# EAGLE design avr_plc (EAGLE 9.6.0)
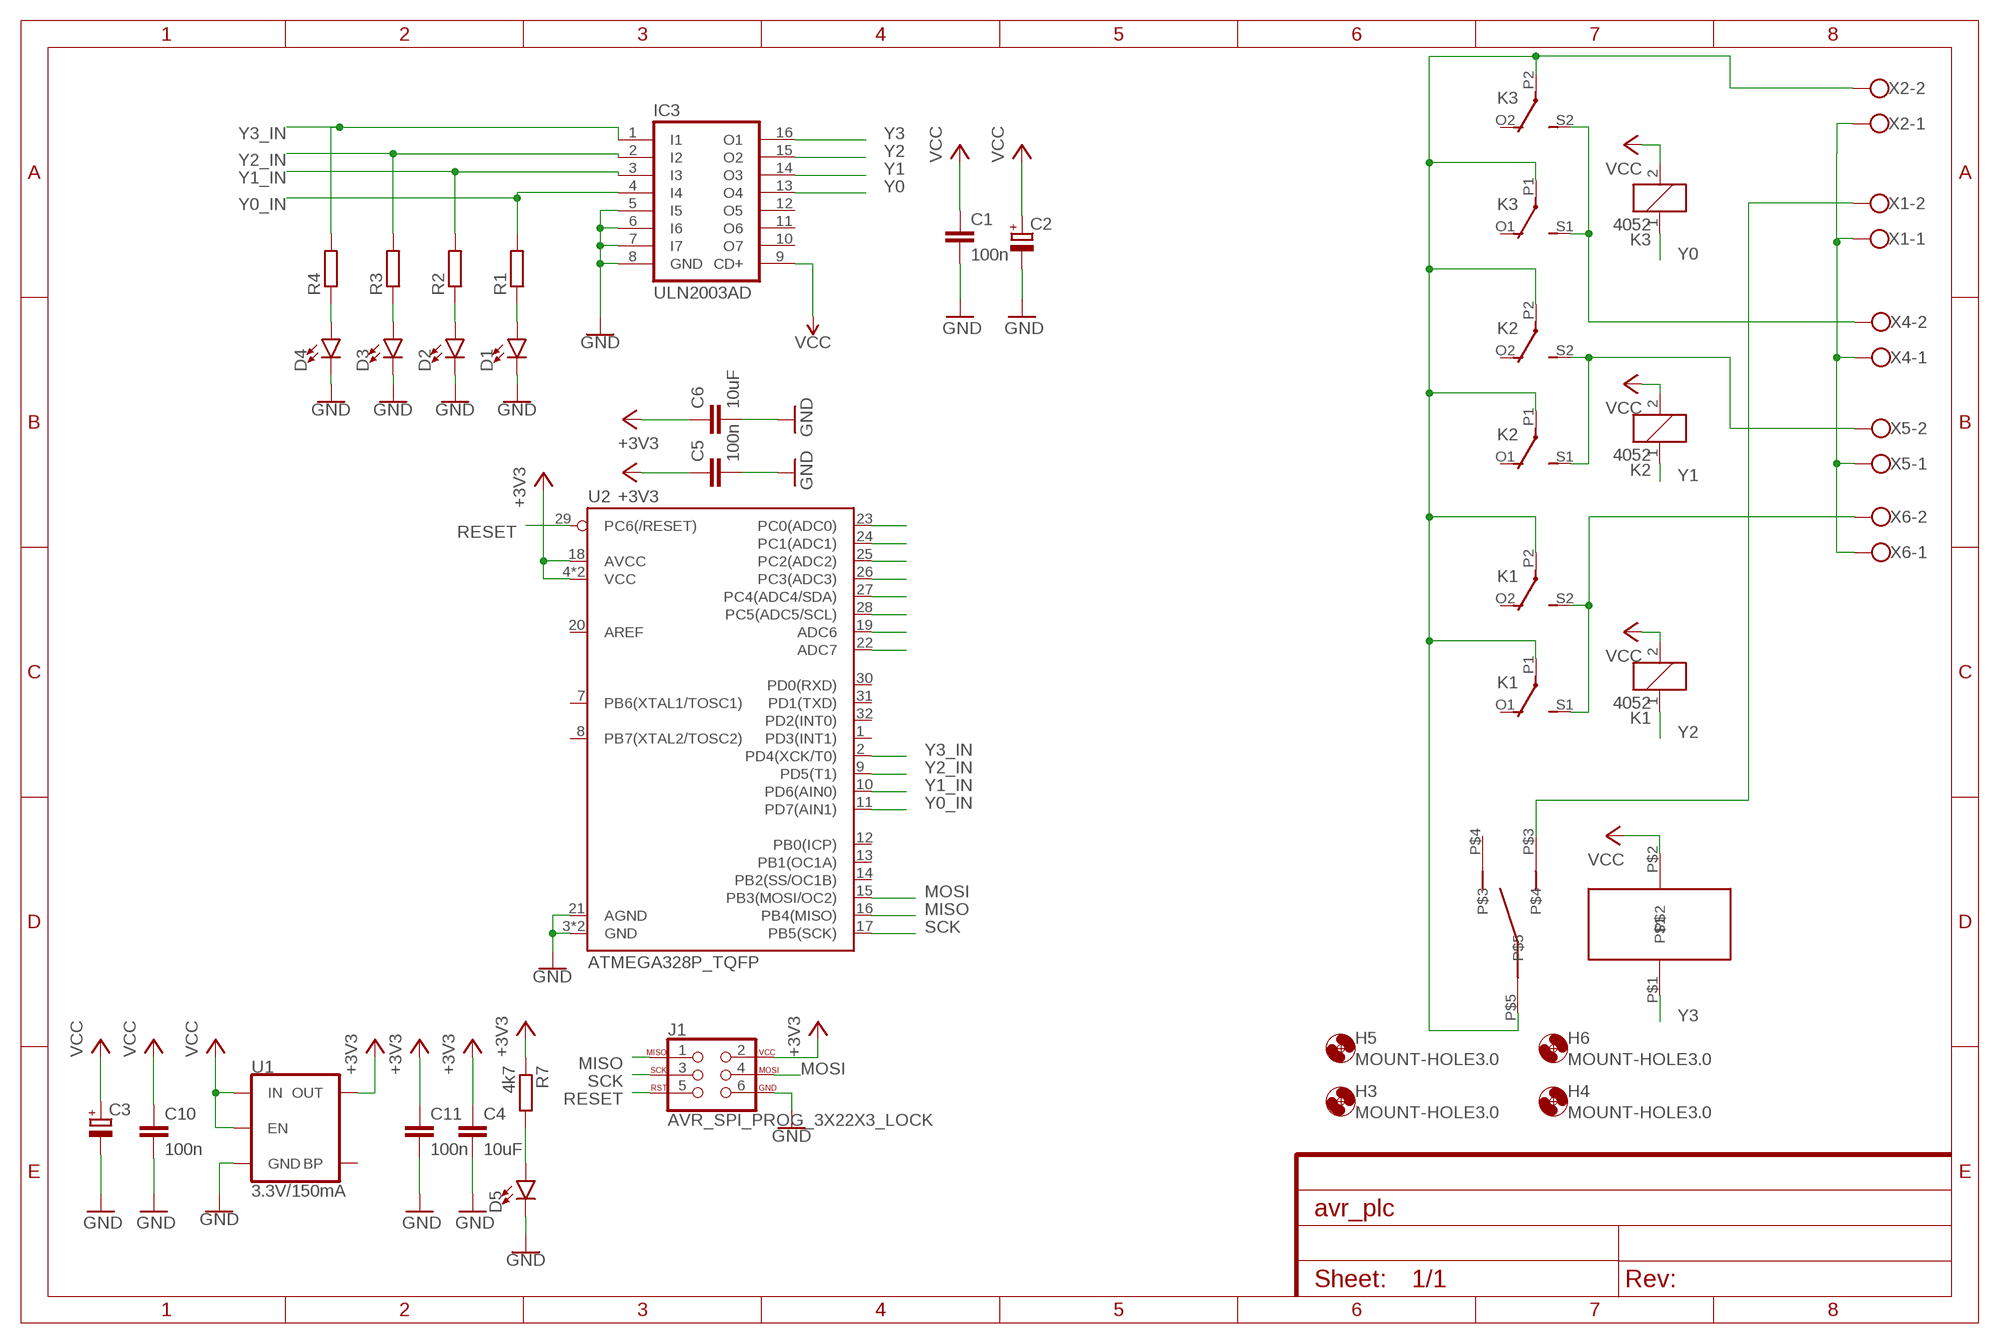
[diagram p0: schematic, sheet 1]

## Parts
C1  100n  C-EUC0805  [C0805]
C2  CPOL-EU153CLV-0810  [153CLV-0810]
C3  CPOL-EU153CLV-0810  [153CLV-0810]
C4  10uF  C-EUC0805  [C0805]
C5  100n  C-EUC0805  [C0805]
C6  10uF  C-EUC0805  [C0805]
C10  100n  C-EUC0805  [C0805]
C11  100n  C-EUC0805  [C0805]
D1  LED1206  [LED-1206]
D2  LED1206  [LED-1206]
D3  LED1206  [LED-1206]
D4  LED1206  [LED-1206]
D5  LED1206  [LED-1206]
H3  MOUNT-HOLE3.0  [3,0]
H4  MOUNT-HOLE3.0  [3,0]
H5  MOUNT-HOLE3.0  [3,0]
H6  MOUNT-HOLE3.0  [3,0]
IC3  ULN2003AD  [SO16]
J1  AVR_SPI_PROG_3X22X3_LOCK  [2X3_LOCK]
K1  4052  [F4052]
K2  4052  [F4052]
K3  4052  [F4052]
R1  R-EU_R0805  [R0805]
R2  R-EU_R0805  [R0805]
R3  R-EU_R0805  [R0805]
R4  R-EU_R0805  [R0805]
R7  4k7  R-EU_M0805  [M0805]
U1  3.3V/150mA  V_REG_MIC52053.3V  [SOT23-5]
U2  ATMEGA328P_TQFP  [TQFP32-08]
U$1  T9G_RELAY  [T9G_RELAY]
X1  W239-302  [W239-302]
X2  W239-302  [W239-302]
X4  W237-102  [W237-102]
X5  W237-102  [W237-102]
X6  W237-102  [W237-102]

## Nets
+3V3: C4.1 C5.1 C6.1 C11.1 J1.2 R7.1 U1.5(OUT) U2.4(VCC) U2.6(VCC) U2.18(AVCC)
GND: C1.2 C2.- C3.- C4.2 C5.2 C6.2 C10.2 C11.2 D1.C D2.C D3.C D4.C D5.C IC3.5(I5) IC3.6(I6) IC3.7(I7) IC3.8(GND) J1.6 U1.2(GND) U2.3(GND) U2.5(GND) U2.21(AGND)
MISO: J1.1 U2.16(PB4(MISO))
MOSI: J1.4 U2.15(PB3(MOSI/OC2))
N$2: D1.A R1.1
N$4: D2.A R2.1
N$6: D3.A R3.1
N$8: D4.A R4.1
N$9: D5.A R7.2
N$10: K1.P1(2:P) K1.P2(3:P) K2.P1(2:P) K2.P2(3:P) K3.P1(2:P) K3.P2(3:P) U$1.P$5 X2.2
N$11: U$1.P$3 X1.2
N$16: U2.23(PC0(ADC0))
N$17: X1.1 X2.1 X4.1 X5.1 X6.1
N$18: U2.24(PC1(ADC1))
N$19: U2.25(PC2(ADC2))
N$20: K1.S1(2:S) K1.S2(3:S) X6.2
N$21: K2.S1(2:S) K2.S2(3:S) X5.2
N$22: K3.S1(2:S) K3.S2(3:S) X4.2
N$23: U2.26(PC3(ADC3))
N$24: U2.27(PC4(ADC4/SDA))
N$25: U2.28(PC5(ADC5/SCL))
N$26: U2.19(ADC6)
N$27: U2.22(ADC7)
RESET: J1.5 U2.29(PC6(/RESET))
SCK: J1.3 U2.17(PB5(SCK))
VCC: C1.1 C2.+ C3.+ C10.1 IC3.9(CD+) K1.2 K2.2 K3.2 U1.1(IN) U1.3(EN) U$1.P$2
Y0: IC3.13(O4) K3.1
Y0_IN: IC3.4(I4) R1.2 U2.11(PD7(AIN1))
Y1: IC3.14(O3) K2.1
Y1_IN: IC3.3(I3) R2.2 U2.10(PD6(AIN0))
Y2: IC3.15(O2) K1.1
Y2_IN: IC3.2(I2) R3.2 U2.9(PD5(T1))
Y3: IC3.16(O1) U$1.P$1
Y3_IN: IC3.1(I1) R4.2 U2.2(PD4(XCK/T0))
Unconnected: IC3.10(O7) IC3.11(O6) IC3.12(O5) K1.O1(2:O) K1.O2(3:O) K2.O1(2:O) K2.O2(3:O) K3.O1(2:O) K3.O2(3:O) U1.4(BP) U2.1(PD3(INT1)) U2.7(PB6(XTAL1/TOSC1)) U2.8(PB7(XTAL2/TOSC2)) U2.12(PB0(ICP)) U2.13(PB1(OC1A)) U2.14(PB2(SS/OC1B)) U2.20(AREF) U2.30(PD0(RXD)) U2.31(PD1(TXD)) U2.32(PD2(INT0)) U$1.P$4

## Library data of the parts
C1 C4-C6 C10 C11 = rcl:C-EU: CAPACITOR, European symbol; SPICEPREFIX: C
C2 C3 = rcl:CPOL-EU: POLARIZED CAPACITOR, European symbol; SPICEPREFIX: C
D1-D5 = SparkFun-LED:LED: LED (Generic) Standard schematic elements and footprints for 5mm, 3mm, 1206, and 0603 sized LEDs. Generic LEDs with no color specified.
H3-H6 = holes:MOUNT-HOLE: MOUNTING HOLE with drill center marker
IC3 = uln-udn:ULN2003A: DRIVER ARRAY
J1 = SparkFun-Connectors:AVR_SPI_PROG_3X2: AVR ISP 6 Pin This is the reduced ISP connector for AVR programming. Common on Arduino. This footprint will take up less PCB space and can be used with a 10-pin to 6-pin adapter such as SKU: BOB-08508 **Special note about "TEST_POINT" package. The stop mask is on the top side, so if you want your programming test points to be on the bottom of your board, make sure to place this package on the bottom side of the board. This also ensure that the orientation to program from the bottom side will be correct. SparkFun Products: SparkFun ISP Pogo Adapter <https://www.sparkfun.com/products/11591> - NS Tiny AVR Programmer <https://www.sparkfun.com/products/11801> -PTH
K1-K3 = relay:4052: RELAY 2 x switch, Finder; OC_FARNELL: unknown; OC_NEWARK: unknown
R1-R4 R7 = rcl:R-EU_: RESISTOR, European symbol; SPICEPREFIX: R
U1 = SparkFun-IC-Power:V_REG_MIC5205: V_REG MIC5205 Standard 3.3V, 5V, and Adjustable 150mA LDO voltage regulator in SOT-23 layout. Micrel part MIC5205. BP (by-pass) pin is used to lower output noise with 470pF cap, may be left open. On the adjustable version BP is used to set output.; PROD_ID: VREG-00822
U2 = SparkFun-IC-Microcontroller:ATMEGA328P_TQFP: Popular 328P in QFP Storefront component: ATmega328 - TQFP <https://www.sparkfun.com/products/13448> (COM-13448) Datasheet <http://www.sparkfun.com/datasheets/Components/SMD/ATMega328.pdf> SparkFun Products SparkFun RedBoard - Programmed with Arduino <https://www.sparkfun.com/products/12757> (DEV-12757) Arduino Pro Mini 328 - 5V/16MHz <https://www.sparkfun.com/products/11113> (DEV-11113) Arduino Pro Mini 328 - 3.3V/8MHz <https://www.sparkfun.com/products/11114> (DEV-11114) SparkFun OpenLog <https://www.sparkfun.com/products/13712> (DEV-13712) SparkFun MicroView - OLED Arduino Module <https://www.sparkfun.com/products/12923> (DEV-12923) SparkFun Digital Sandbox <https://www.sparkfun.com/products/12651> (DEV-12651) SparkFun PicoBoard <https://www.sparkfun.com/products/11888> (WIG-11888) Arduino Fio <https://www.sparkfun.com/products/10116> (DEV-10116) LilyPad Arduino 328 Main Board <https://www.sparkfun.com/products/13342> (DEV-13342) SparkFun RedStick <https://www.sparkfun.com/products/13741> (DEV-13741) LilyPad MP3 <https://www.sparkfun.com/products/11013> (DEV-11013) LilyPad Arduino SimpleSnap <https://www.sparkfun.com/products/10941> (DEV-10941) SparkFun Stepoko <https://www.sparkfun.com/products/13899> (ROB-13899) SparkFun Geiger Counter <https://www.sparkfun.com/products/11345> (SEN-11345) SparkFun EL Sequencer <https://www.sparkfun.com/products/12781> (COM-12781) Arduino Pro 328 - 5V/16MHz <https://www.sparkfun.com/products/10915> (DEV-10915) CryptoCape <https://www.sparkfun.com/products/12773> (DEV-12773) SparkFun IR Thermometer Evaluation Board - MLX90614 <https://www.sparkfun.com/products/10740> (SEN-10740) SparkFun RedBot Mainboard <https://www.sparkfun.com/products/12097> (ROB-12097) Arduino Pro 328 - 3.3V/8MHz <https://www.sparkfun.com/products/10914> (DEV-10914) SparkFun Block for Intel® Edison - Arduino <https://www.sparkfun.com/products/13036> (DEV-13036) SparkFun Simon Says - Surface Mount Soldering Kit <https://www.sparkfun.com/products/10935> (KIT-10935) SparkFun 7-Segment Serial Display - Red <https://www.sparkfun.com/products/11441> (COM-11441) SparkFun 7-Segment Serial Display - White <https://www.sparkfun.com/products/11629> (COM-11629) SparkFun 7-Segment Serial Display - Yellow <https://www.sparkfun.com/products/11443> (COM-11443) SparkFun 7-Segment Serial Display - Kelly Green <https://www.sparkfun.com/products/11440> (COM-11440) SparkFun 7-Segment Serial Display - Blue <https://www.sparkfun.com/products/11442> (COM-11442) SparkFun OpenSegment Serial Display - 20mm (Blue) <https://www.sparkfun.com/products/11647> (COM-11647) SparkFun OpenSegment Serial Display - 20mm (Green) <https://www.sparkfun.com/products/11646> (COM-11646) SparkFun OpenSegment Serial Display - 20mm (White) <https://www.sparkfun.com/products/11648> (COM-11648) SparkFun OpenSegment Serial Display - 20mm (Red) <https://www.sparkfun.com/products/11644> (COM-11644) SparkFun OpenSegment Serial Display - 20mm (Yellow) <https://www.sparkfun.com/products/11645> (COM-11645) SparkFun OpenSegment Shield <https://www.sparkfun.com/products/13190> (DEV-13190); PROD_ID: IC-09069
U$1 = my_library:T9G_RELAY
X1 X2 = con-wago-500:W239-302: WAGO SCREW CLAMP; OC_FARNELL: unknown; OC_NEWARK: unknown
X4-X6 = con-wago-500:W237-102: WAGO SCREW CLAMP; MPN: 237-102; OC_FARNELL: unknown; OC_NEWARK: 70K9898

## Board
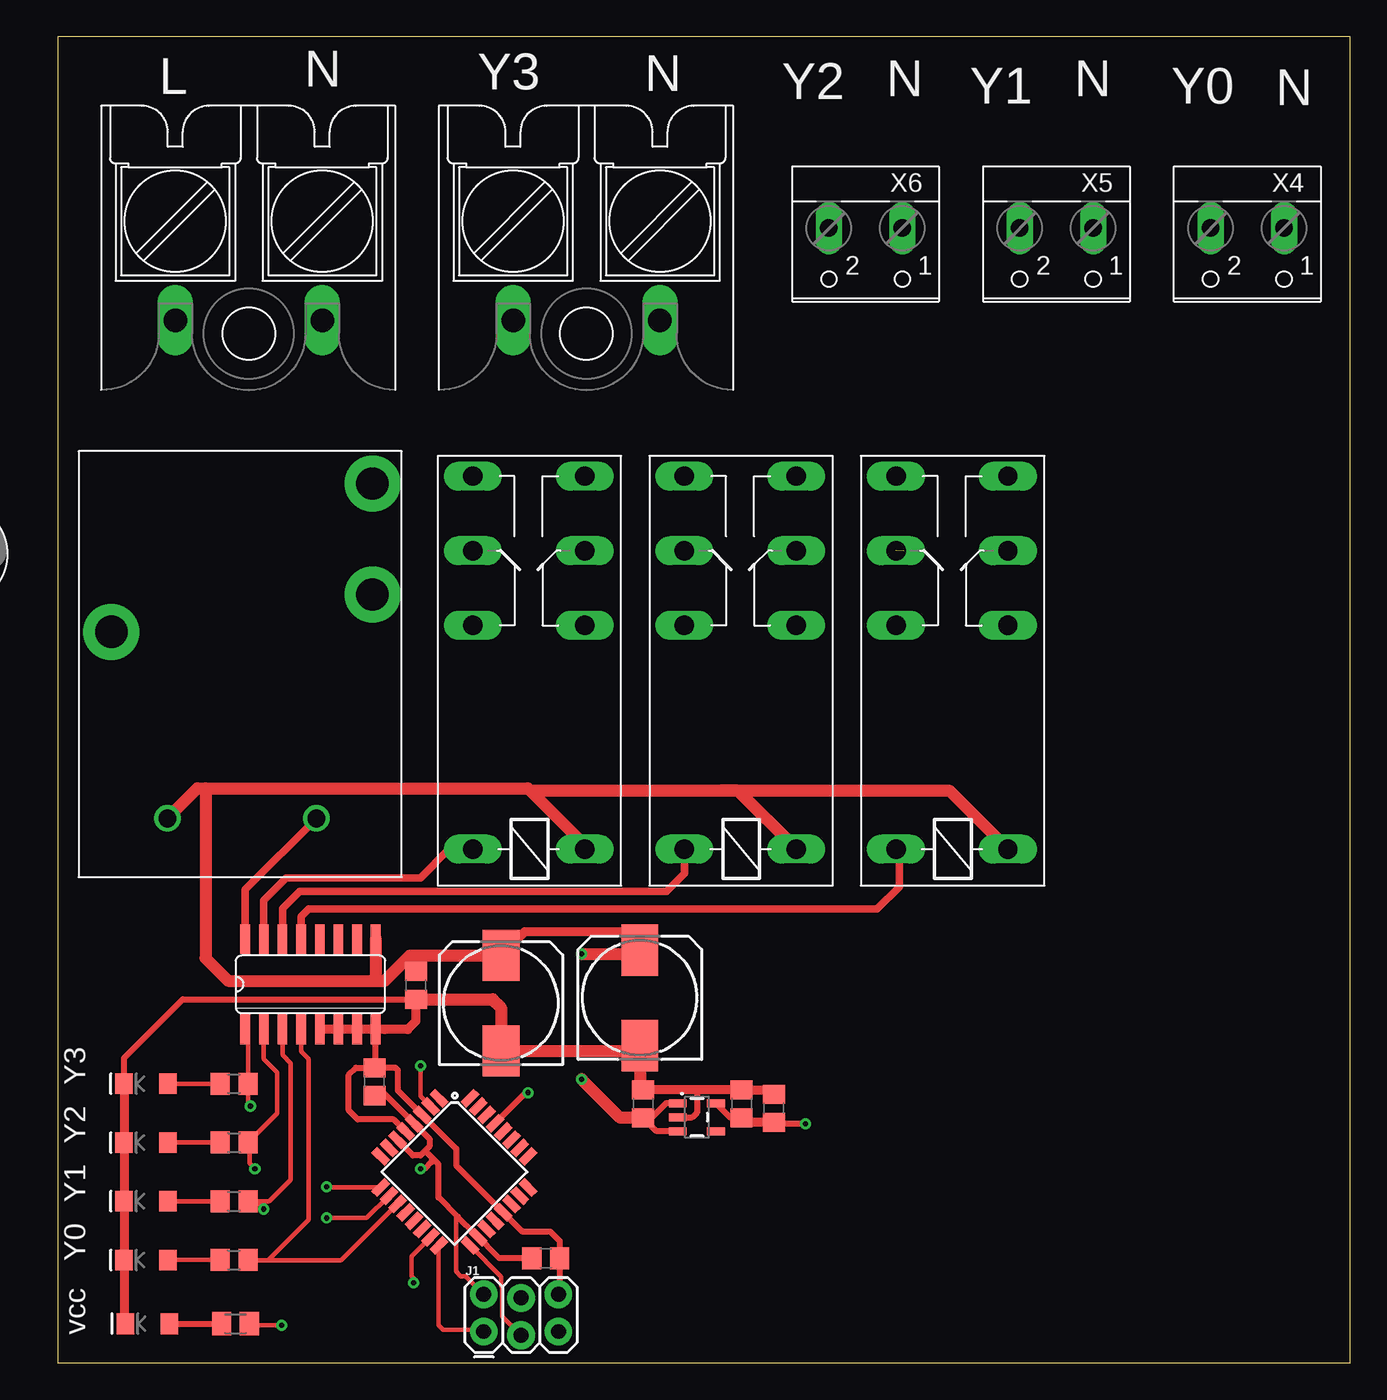
[diagram p1: board, top side]
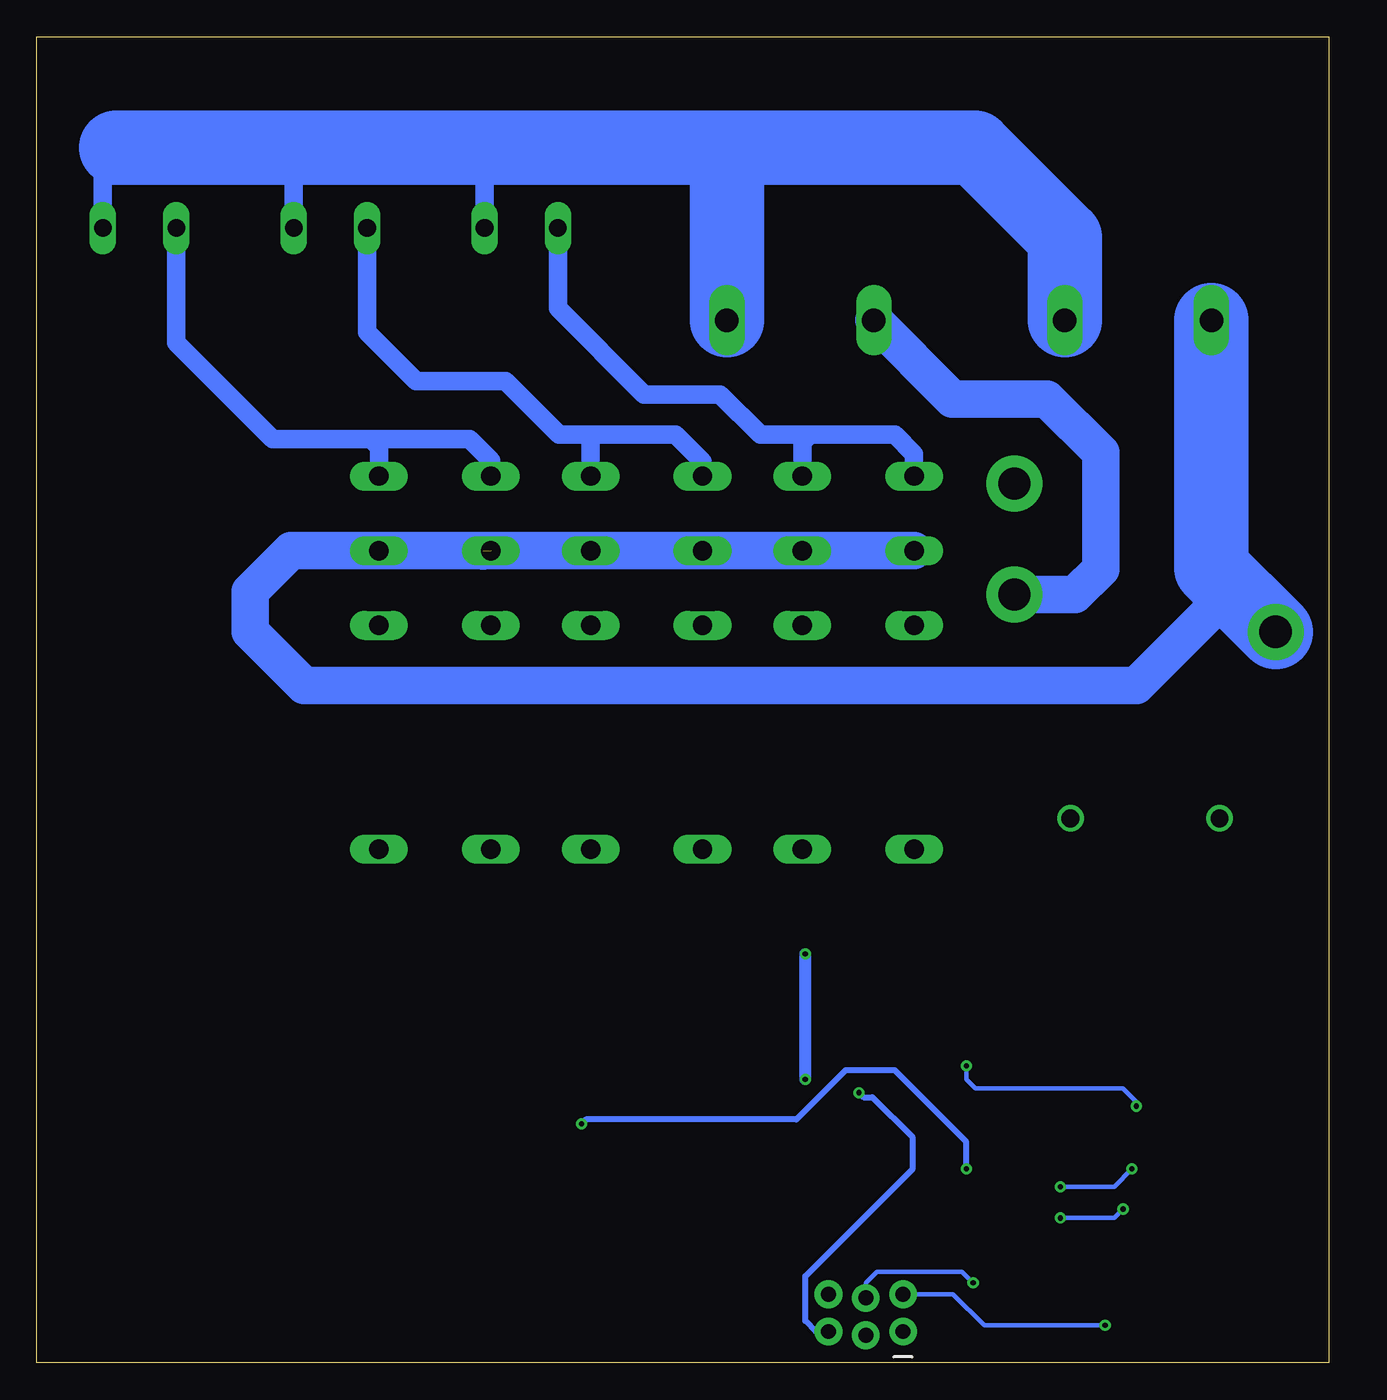
[diagram p2: board, bottom side, seen from below]

Size 88 x 90.3 mm. Coordinates in mm from the lower left corner, seen from the top.
Outline: 0,0 88,0 88,90.31 0,90.31 0,0
Copper layers (1*16): Top 0.035mm / dielectric 1.5mm / Bottom 0.035mm
Design rules "default": minimum track width 6mil, minimum drill 0.35mm, track to track 6mil, track to pad 6mil, pad to pad 6mil, via to via 6mil, smd to smd 6mil, copper to edge 40mil, drill to drill 6mil, minimum pad ring 10mil, minimum via ring 8mil, stop-mask expansion 4mil, vias tented up to drill 0mil, thermal gap 10mil

### Footprints (pad centres in the part's own frame; a part is rotated, then mirrored left to right if it is on the bottom)
C0805 = smd 1.3 x 1.5: 1 -0.95,0; 2 0.95,0
153CLV-0810 = smd 3.5 x 2.5: + 3.25,0; - -3.25,0
LED-1206 = smd 1.2 x 1.4: A -1.5,0; C 1.5,0
3,0 = hole 3: 0,0
SO16 = smd 0.66 x 2.032: 1 -4.445,-3.073; 2 -3.175,-3.073; 3 -1.905,-3.073; 4 -0.635,-3.073; 5 0.635,-3.073; 6 1.905,-3.073; 7 3.175,-3.073; 8 4.445,-3.073; 9 4.445,3.073; 10 3.175,3.073; 11 1.905,3.073; 12 0.635,3.073; 13 -0.635,3.073; 14 -1.905,3.073; 15 -3.175,3.073; 16 -4.445,3.073
2X3_LOCK = drill 1.016 pad 1.88: 1 0,0.127; 2 0,2.667; 3 2.54,-0.127; 4 2.54,2.413; 5 5.08,0.127; 6 5.08,2.667
F4052 = drill 1.321 long: 1 -3.81,3.81; 2 -3.81,-3.81; O1 11.43,-3.81; O2 11.43,3.81; P1 16.51,-3.81; P2 16.51,3.81; S1 21.59,-3.81; S2 21.59,3.81
R0805 = smd 1.3 x 1.5: 1 -0.95,0; 2 0.95,0
M0805 = smd 1.3 x 1.6: 1 -0.95,0; 2 0.95,0
SOT23-5 = smd 0.55 x 1.2: 1 -0.95,-1.3; 2 0,-1.3; 3 0.95,-1.3; 4 0.95,1.3; 5 -0.95,1.3
TQFP32-08 = smd 1.27 x 0.559: 1 -4.293,2.8; 2 -4.293,2; 3 -4.293,1.2; 4 -4.293,0.4; 5 -4.293,-0.4; 6 -4.293,-1.2; 7 -4.293,-2; 8 -4.293,-2.8; 17 4.293,-2.8; 18 4.293,-2; 19 4.293,-1.2; 20 4.293,-0.4; 21 4.293,0.4; 22 4.293,1.2; 23 4.293,2; 24 4.293,2.8 | smd 0.559 x 1.27: 9 -2.8,-4.293; 10 -2,-4.293; 11 -1.2,-4.293; 12 -0.4,-4.293; 13 0.4,-4.293; 14 1.2,-4.293; 15 2,-4.293; 16 2.8,-4.293; 25 2.8,4.293; 26 2,4.293; 27 1.2,4.293; 28 0.4,4.293; 29 -0.4,4.293; 30 -1.2,4.293; 31 -2,4.293; 32 -2.8,4.293
T9G_RELAY = drill 1.2: P$1 16.19,4; P$2 6.03,4 | drill 2.2 pad 3.81: P$3 20,19.24; P$4 20,26.8; P$5 2.22,16.7
W239-302 = drill 1.6 long: 1 -5,5; 2 5,5
W237-102 = drill 1.194 long: 1 -2.5,-1.27; 2 2.5,-1.27

### Placement (x,y rotation side)
C1  24.38,25.71 270 top
C2  30.18,24.49 90 top
C3  39.63,24.86 90 top
C4  48.75,17.33 90 top
C5  21.56,19.14 90 top
C6  33.22,7.12 0 top
C10  39.85,17.64 90 top
C11  46.56,17.64 90 top
D1  6,7 180 top
D2  6,11 180 top
D3  6,15 180 top
D4  6,19 180 top
D5  6.09,2.66 180 top
H3  -27.61,50.78 0 top  (outside the outline)
H4  -6.89,55.06 0 top  (outside the outline)
H5  96,45 0 top  (outside the outline)
H6  96,20 0 top  (outside the outline)
IC3  17.2,25.78 0 top
J1  29,2 0 top
K1  32.06,38.79 90 top
K2  46.47,38.79 90 top
K3  60.88,38.79 90 top
R1  12,7 0 top
R2  12,11 0 top
R3  12,15 0 top
R4  12,19 0 top
R7  12.09,2.66 180 top
U1  43.51,16.72 270 top
U2  27,13 315 top
U$1  1.42,33.07 0 top
X1  36,76 180 top
X2  13,76 180 top
X4  81,76 180 top
X5  68,76 180 top
X6  55,76 180 top

### Tracks (layer width: path | path; a pad name or v marks a point on that pad's centre or on a via)
+3V3  (via drill 0.35)
  Top 0.305: J1.2 27.77,5.9 27.43,5.9 27.1,6.23 27.1,8.36 27.13,8.39 27.13,9.86 27.22,9.95 | v15.24,2.54 13.16,2.54 R7.1
  Top 0.406: C11.1 45.8,16.69 U1.5 | C5.1 22.05,18.52 U2.4 25.3,15.27 25.3,14.74 24.99,14.43 | U2.6 24.18,14.13 24.69,14.13 24.99,14.43 | U2.18 28.44,8.73 | 28.44,8.73 27.22,9.95 25.91,11.26 25.91,13.52 25.45,13.98 | 25.45,13.98 24.99,14.43 | C6.1 30.05,7.12 28.44,8.73 | 25.45,13.98 25.45,13.67 24.99,13.21 v24.69,13.21 | v50.9,16.26 48.87,16.26 C4.1
  Top 0.61: C4.1 46.87,16.38 C11.1
  Bottom 0.305: J1.2 25.59,4.67 23.47,2.54 v15.24,2.54
  Bottom 0.406: v24.69,13.21 24.69,15.04 29.57,19.92 32.92,19.92 36.27,16.57 50.6,16.57 v50.9,16.26
GND
  Top 0.406: D5.C 4.53,2.66 4.36,2.49 | 20.25,22.58 IC3.7 | 22.45,22.7 22.25,22.7 | C10.2 39.93,18.59 43.51,18.59 | 43.51,18.59 C11.2 | U1.2 43.21,16.72 43.51,17.03 43.51,18.59 | C5.2 22.99,20.09 23.16,19.92 23.16,18.53 U2.3 27.13,14.57 27.13,13.44 U2.21 31.62,8.95 33.53,8.95 34.17,8.3 C6.2 34.17,4.76 J1.6 | U2.5 22.87,16.57 20.42,16.57 19.81,17.18 19.81,19.61 20.29,20.09 C5.2 | C5.2 21.64,20.18 IC3.8 | D4.C 4.5,20.76 8.5,24.76 C1.2
  Top 0.61: C1.2 24.38,23.27 23.82,22.7 22.25,22.7 IC3.8 IC3.7 IC3.6 IC3.5 | D4.C D3.C D2.C D1.C 4.5,2.75 D5.C | C3.- 38.93,20.91 | C2.- 31.5,21.24 | C4.2 48.44,18.59 C11.2 39.93,18.59 39.63,18.89
  Top 0.813: C1.2 29.6,24.76 30.18,24.19 C2.- 39.26,21.24 C3.- 39.63,18.89 39.93,18.59
MISO
  Top 0.305: J1.1 28.89,2.24 26.21,2.24 25.91,2.54 25.91,7.95 U2.16
MOSI  (via drill 0.35)
  Top 0.305: U2.15 24.08,7.25 24.08,5.9 24.38,5.59 v24.23,5.44
  Bottom 0.305: J1.4 31.54,5.45 30.79,6.2 25.91,6.2 24.99,6.2 v24.23,5.44
N$2
  Top 0.305: D1.A R1.1
N$4
  Top 0.305: R2.1 D2.A
N$6
  Top 0.305: D3.A R3.1
N$8
  Top 0.305: R4.1 D4.A
N$9
  Top 0.406: D5.A R7.2
N$10  (1 unrouted)
  Bottom 2.54: 8,64.72 8,51.24 13.11,46.13 69.8,46.13 73.46,49.79 73.46,52.53 70.69,55.3 K3.P1 57.58,55.3 | K1.P2 K1.P1 K2.P2 K2.P1 57.58,55.3 | 57.58,55.3 57.61,55.28
  Bottom 5.08: X2.2 8,64.72 8,54.14 U$1.P$5
N$11
  Bottom 2.54: U$1.P$3 17.29,52.31 15.54,54.06 15.54,61.98 19.2,65.64 25.64,65.64 X1.2
N$17
  Bottom 1.27: X6.1 57.5,82.55 57.3,82.75 | X5.1 70.5,82.53 70.71,82.75 | X4.1 83.5,81.85 82.6,82.75
  Bottom 5.08: X2.1 18,76.63 24.12,82.75 40.84,82.75 | 40.84,82.75 57.3,82.75 70.71,82.75 82.6,82.75 | X1.1 41,82.59 40.84,82.75
N$20
  Bottom 1.27: K1.S2 28.25,61.88 29.57,63.2 35.36,63.2 | K1.S1 35.87,62.69 35.36,63.2 | 35.36,63.2 38.71,63.2 41.45,65.94 46.63,65.94 52.5,71.81 X6.2
N$21
  Bottom 1.27: K2.S2 42.66,61.36 44.5,63.2 50.29,63.2 | X5.2 65.5,70.18 62.18,66.86 56.08,66.86 52.43,63.2 50.29,63.2 | K2.S1 50.28,63.19 50.29,63.2
N$22
  Bottom 1.27: K3.S2 57.07,61.44 58.52,62.89 65.23,62.89 | 65.23,62.89 71.93,62.89 78.5,69.46 X4.2 | K3.S1 64.69,62.36 65.23,62.89
RESET  (via drill 0.35)
  Top 0.406: U2.29 31.83,18.39 v32,18.39
  Bottom 0.406: J1.5 34.94,2.13 35.66,2.85 35.66,5.9 28.35,13.21 28.35,15.35 31.09,18.09 31.7,18.09 v32,18.39
SCK
  Top 0.305: J1.3 30.25,3.17 30.25,5.18 30.18,5.25 30.18,5.86 U2.17
VCC  (via drill 0.35)
  Top 0.406: U1.1 41.41,17.67 40.43,16.69 C10.1 40.16,16.38 40.77,15.77 U1.3
  Top 0.559: 21.59,28.8 IC3.9
  Top 0.61: C2.+ 31.8,29.37 37.8,29.37 38.37,29.37 C3.+
  Top 0.813: U$1.P$2 9.49,39.12 10.06,39.12 | 32.16,38.97 32,39.12 10.06,39.12 | 32.16,38.97 35.66,35.46 35.66,35.19 K1.2 | 32.16,38.97 45.11,38.97 | 45.11,38.97 60.7,38.97 K3.2 | K2.2 46.29,38.97 45.11,38.97 | 10.06,39.12 10.06,27.54 11.58,26.01 21.64,26.01 | 21.64,26.01 22.25,26.01 23.98,27.74 24.38,27.74 | IC3.9 21.64,26.02 21.64,26.01 | 24.38,27.74 C2.+ | C1.1 24.38,27.74 | C10.1 38.28,16.69 v35.66,19.31 | v35.66,27.84 39.36,27.84 C3.+
  Bottom 0.813: v35.66,19.31 v35.66,27.84
Y0
  Top 0.508: IC3.13 16.56,30.38 17.07,30.89 55.78,30.89 57.3,32.41 57.3,34.75 K3.1
Y0_IN
  Top 0.305: IC3.4 16.56,21.21 17.07,20.7 17.07,9.73 14.33,6.98 13.11,6.98 | 13.11,6.98 12.97,6.98 R1.2 | U2.11 19.29,6.98 13.11,6.98
Y1
  Top 0.508: K2.1 42.66,33.32 41.45,32.11 16.46,32.11 15.29,30.94 IC3.14
Y1_IN  (via drill 0.35)
  Top 0.305: IC3.3 15.29,20.95 15.85,20.39 15.85,12.47 14.38,11 13.11,11 | 13.11,11 R2.2 | U2.10 21.03,9.86 v18.29,9.86 | v14.02,10.47 13.49,11 13.11,11
  Bottom 0.305: v18.29,9.86 14.63,9.86 v14.02,10.47
Y2
  Top 0.508: K1.1 26.64,34.98 24.69,33.02 15.54,33.02 14.02,31.5 IC3.15
Y2_IN  (via drill 0.35)
  Top 0.305: IC3.2 14.02,20.7 14.94,19.78 14.94,16.98 13.05,15.1 | 13.05,15.1 R3.2 | U2.9 18.34,11.95 v18.29,11.99 | v13.41,13.21 13.05,13.57 13.05,15.1
  Bottom 0.305: v18.29,11.99 14.63,11.99 v13.41,13.21
Y3
  Top 0.508: IC3.16 12.75,32.22 U$1.P$1
Y3_IN  (via drill 0.35)
  Top 0.305: IC3.1 12.95,22.5 12.95,19.31 | 12.95,19.31 R4.2 | U2.2 24.69,18.14 v24.69,20.22 | v13.11,17.48 12.95,17.64 12.95,19.31
  Bottom 0.305: v24.69,20.22 24.69,19.31 24.08,18.7 14.02,18.7 13.11,17.79 v13.11,17.48

### Text on the board
tNames: L | Y3 | Y2 | Y1 | Y0 | N | N | N | N | N | Y3 | Y2 | Y1 | Y0 | vcc